# EAGLE design MMA7361-Breakout-v11 (EAGLE 5.04)
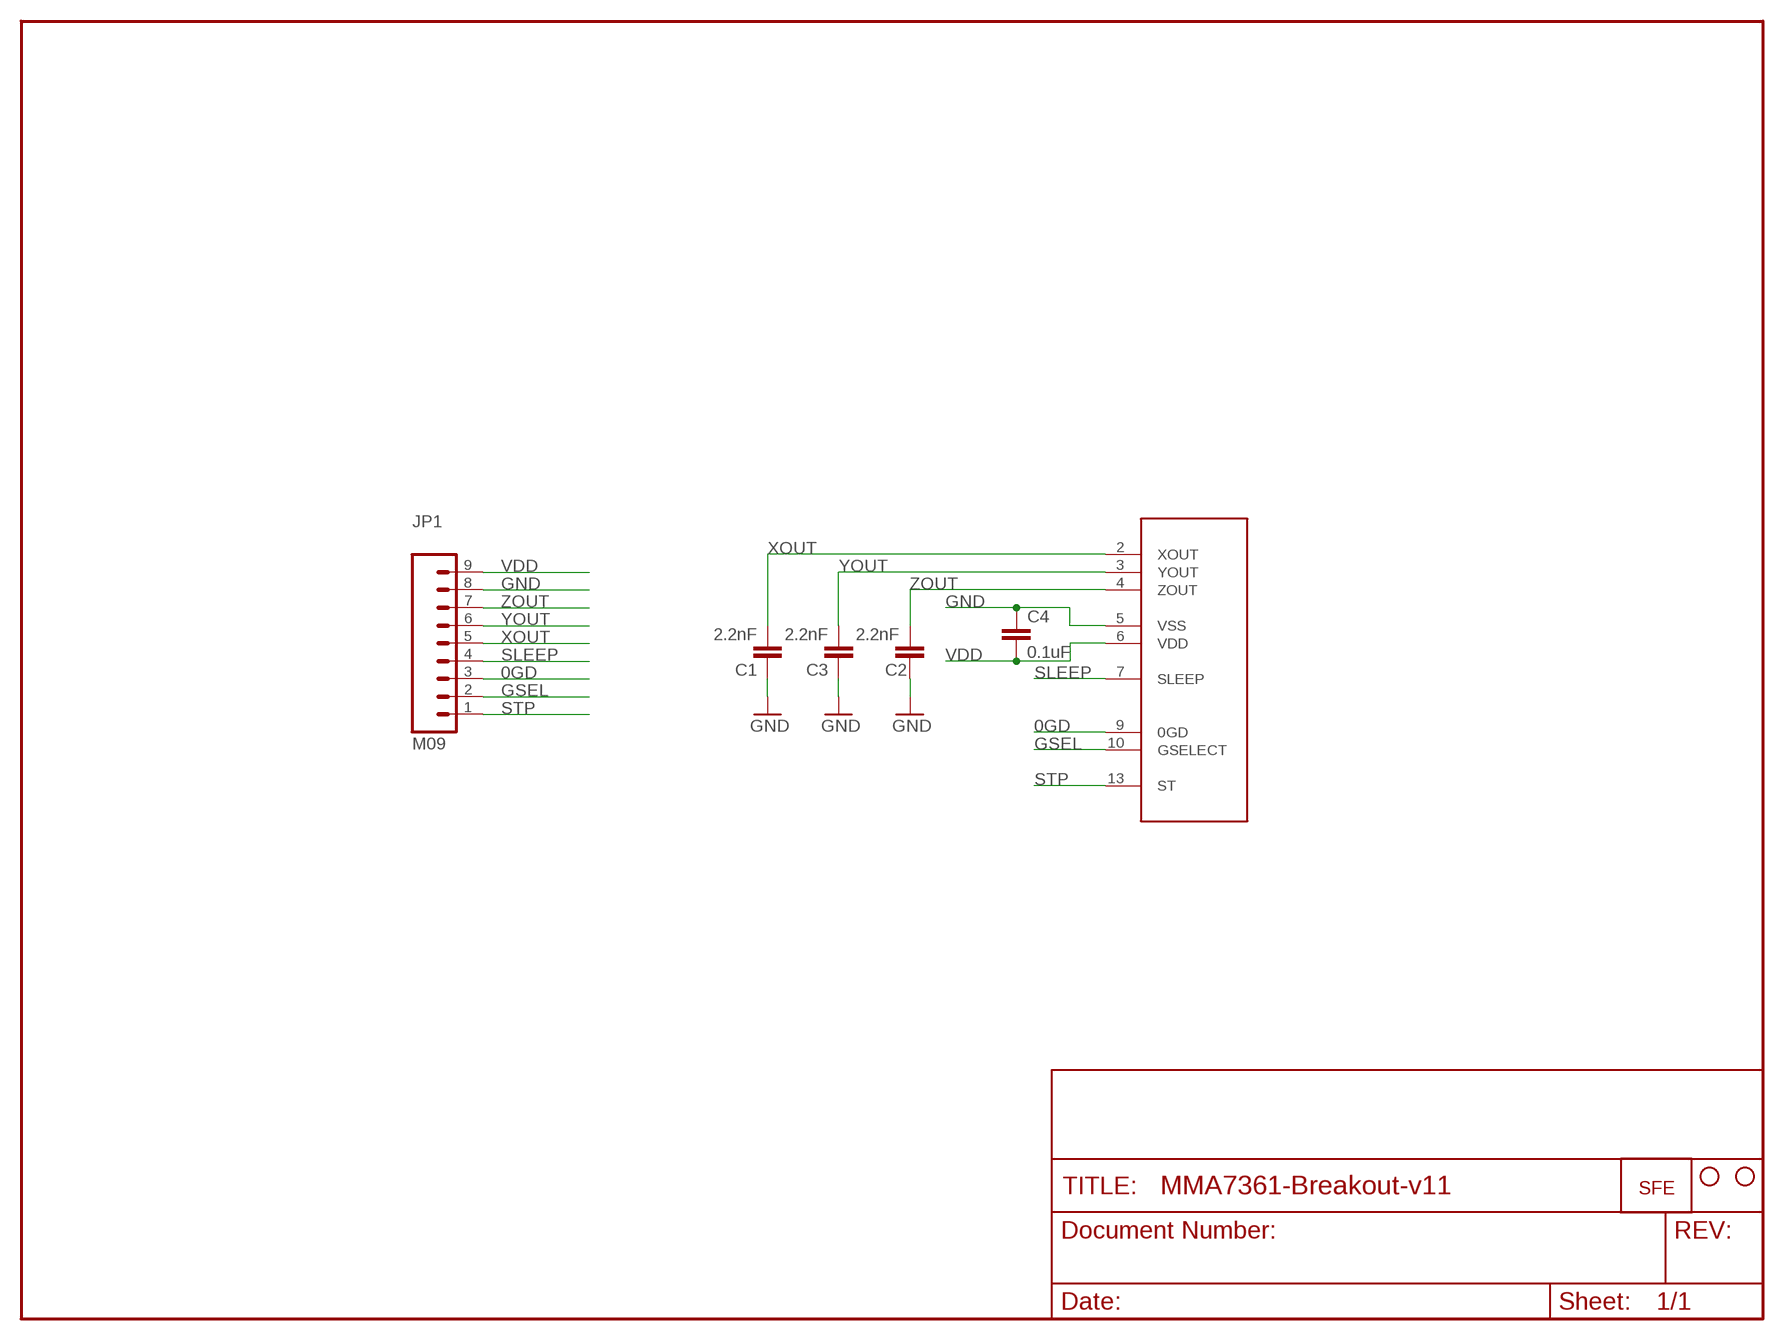
[diagram p0: schematic, sheet 1]

## Parts
C1  2.2nF  CAP0603-CAP  [0603-CAP]
C2  2.2nF  CAP0603-CAP  [0603-CAP]
C3  2.2nF  CAP0603-CAP  [0603-CAP]
C4  0.1uF  CAP0603-CAP  [0603-CAP]
JP1  M09  [1X09]
JP2  STAND-OFF  [STAND-OFF]
JP3  STAND-OFF  [STAND-OFF]
JP4  LOGO-SFESK  [SFE-LOGO-FLAME]
U$1  MMA7361  [LGA14]

## Nets
0GD: JP1.3 U$1.9(0GD)
GND: C1.1 C2.2 C3.1 C4.1 JP1.8 U$1.5(VSS)
GSEL: JP1.2 U$1.10(GSELECT)
SLEEP: JP1.4 U$1.7(SLEEP)
STP: JP1.1 U$1.13(ST)
VDD: C4.2 JP1.9 U$1.6(VDD)
XOUT: C1.2 JP1.5 U$1.2(XOUT)
YOUT: C3.2 JP1.6 U$1.3(YOUT)
ZOUT: C2.1 JP1.7 U$1.4(ZOUT)

## Library data of the parts
C1-C4 = SparkFun:CAP: Capacitor Standard 0603 ceramic capacitor, and 0.1" leaded capacitor.
JP1 = SparkFun:M09: Header 9 Standard 9-pin 0.1" header. Use with straight break away headers (SKU : PRT-00116), right angle break away headers (PRT-00553), swiss pins (PRT-00743), machine pins (PRT-00117), and female headers (PRT-00115).
JP2 JP3 = SparkFun:STAND-OFF: Stand Off This is the mechanical footprint for a #4 phillips button head screw. Use the keepout ring to avoid running the screw head into surrounding components. SKU : PRT-00447
JP4 = SparkFun:LOGO-SFE: Spark Fun Electronics PCB Logo This is the standard Spark Fun Electronics PCB logo.
U$1 = SparkFun:MMA7361

## Board
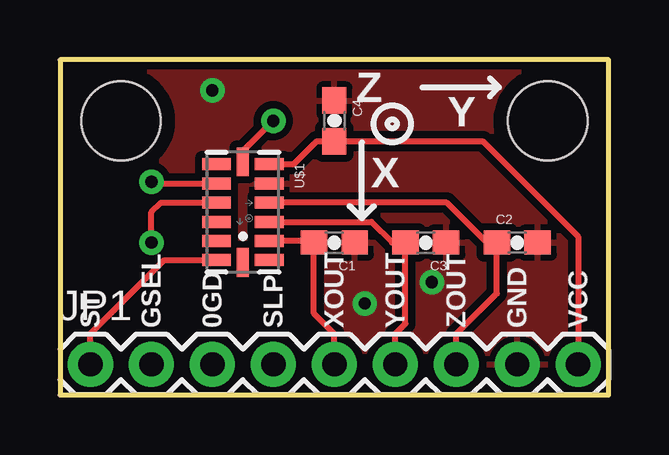
[diagram p1: board, top side]
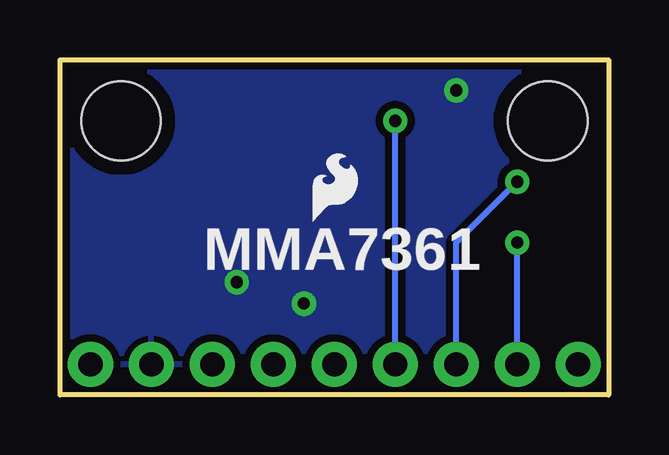
[diagram p2: board, bottom side, seen from below]

Size 22.86 x 13.97 mm. Coordinates in mm from the lower left corner, seen from the top.
Outline: 0,0 22.86,0 22.86,13.97 0,13.97 0,0
Copper layers (1*16): Top 0.035mm / dielectric 1.5mm / Bottom 0.035mm
Design rules "SparkFun": minimum track width 8mil, minimum drill 20mil, track to track 8mil, track to pad 8mil, pad to pad 8mil, via to via 8mil, smd to smd 8mil, copper to edge 9mil, drill to drill 8mil, minimum pad ring 12mil, minimum via ring 10mil, stop-mask expansion 4mil, vias tented up to drill 20mil, thermal gap 10mil

### Footprints (pad centres in the part's own frame; a part is rotated, then mirrored left to right if it is on the bottom)
0603-CAP = smd 1.1 x 1: 1 -0.85,0; 2 0.85,0
1X09 = drill 1.016 pad 1.88 round: 1 0,0; 2 2.54,0; 3 5.08,0; 4 7.62,0; 5 10.16,0; 6 12.7,0; 7 15.24,0; 8 17.78,0; 9 20.32,0
STAND-OFF = hole 3.302: 0,0
LGA14 = smd 0.5 x 1.2: 1 2,1.1; 2 1.2,1.1; 3 0.4,1.1; 4 -0.4,1.1; 5 -1.2,1.1; 6 -2,1.1; 8 -2,-1.1; 9 -1.2,-1.1; 10 -0.4,-1.1; 11 0.4,-1.1; 12 1.2,-1.1; 13 2,-1.1 | smd 1.2 x 0.5: 7 -2.1,0; 14 2.1,0

### Placement (x,y rotation side)
C1  11.43,6.35 180 top
C2  19.05,6.35 0 top
C3  15.24,6.35 180 top
C4  11.43,11.43 270 top
JP1  1.27,1.27 0 top
JP2  2.54,11.43 0 top
JP3  20.32,11.43 0 top
JP4  12.32,7.24 0 bottom
U$1  7.62,7.62 270 top

### Tracks (layer width: path | path; a pad name or v marks a point on that pad's centre or on a via)
0GD  (via drill 0.51)
  Top 0.254: U$1.9 3.88,8.82 v3.81,8.89
  Bottom 0.254: JP1.3 6.35,6.35 v3.81,8.89
GND  (via drill 0.51)
  other vias: 12.7,3.81 15.49,4.7 6.35,12.7
  pour Bottom (isolate 0.305): 0,13.97 0,0 22.86,0 22.86,13.97
  pour Top (isolate 0.305): 0,13.97 0,0 22.86,0 22.86,13.97
GSEL  (via drill 0.51)
  Top 0.254: v3.81,6.35 3.81,7.62 4.21,8.02 U$1.10
  Bottom 0.254: JP1.2 v3.81,6.35
SLEEP  (via drill 0.51)
  Top 0.254: U$1.7 7.62,10.16 v8.89,11.43
  Bottom 0.254: JP1.4 v8.89,11.43
STP
  Top 0.254: JP1.1 1.27,2.54 4.35,5.62 U$1.13
VDD
  Top 0.254: U$1.6 9.75,9.62 10.71,10.58 C4.2 17.61,10.58 21.59,6.6 JP1.9
XOUT
  Top 0.254: U$1.2 10.09,6.42 10.16,6.35 C1.2 10.58,3.39 11.43,2.54 JP1.5
YOUT
  Top 0.254: U$1.3 12.97,7.22 13.84,6.35 C3.2 14.39,2.96 13.97,2.54 JP1.6
ZOUT
  Top 0.254: U$1.4 16.11,8.02 17.78,6.35 C2.1 18.2,4.23 16.51,2.54 JP1.7

### Text on the board
tPlace: Z | Y | X | ST | GSEL | 0GD | SLP | XOUT | YOUT | ZOUT | GND | VCC
bPlace: MMA7361